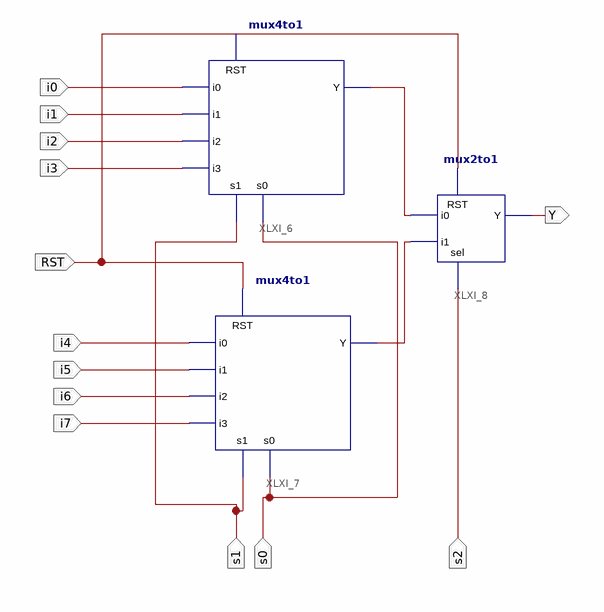
[diagram p0: schematic sheet 1]
// Xilinx ISE schematic mux8to1.sch (artix7) as structural Verilog: 3 symbols, 13 ports
module mux8to1 (
  input  i0,
  input  i1,
  input  i2,
  input  i3,
  input  i4,
  input  i5,
  input  i6,
  input  i7,
  input  s1,
  input  s0,
  input  s2,
  input  RST,
  output Y
);

  wire XLXN_1, XLXN_2;

  mux4to1 XLXI_6 (.i0(i0), .i1(i1), .i2(i2), .i3(i3), .RST(RST), .s0(s0), .s1(s1), .Y(XLXN_1));
  mux4to1 XLXI_7 (.i0(i4), .i1(i5), .i2(i6), .i3(i7), .RST(RST), .s0(s0), .s1(s1), .Y(XLXN_2));
  mux2to1 XLXI_8 (.i0(XLXN_1), .i1(XLXN_2), .RST(RST), .sel(s2), .Y(Y));
endmodule
